# EAGLE design LTX-Rapidfire (EAGLE 6.5.0)
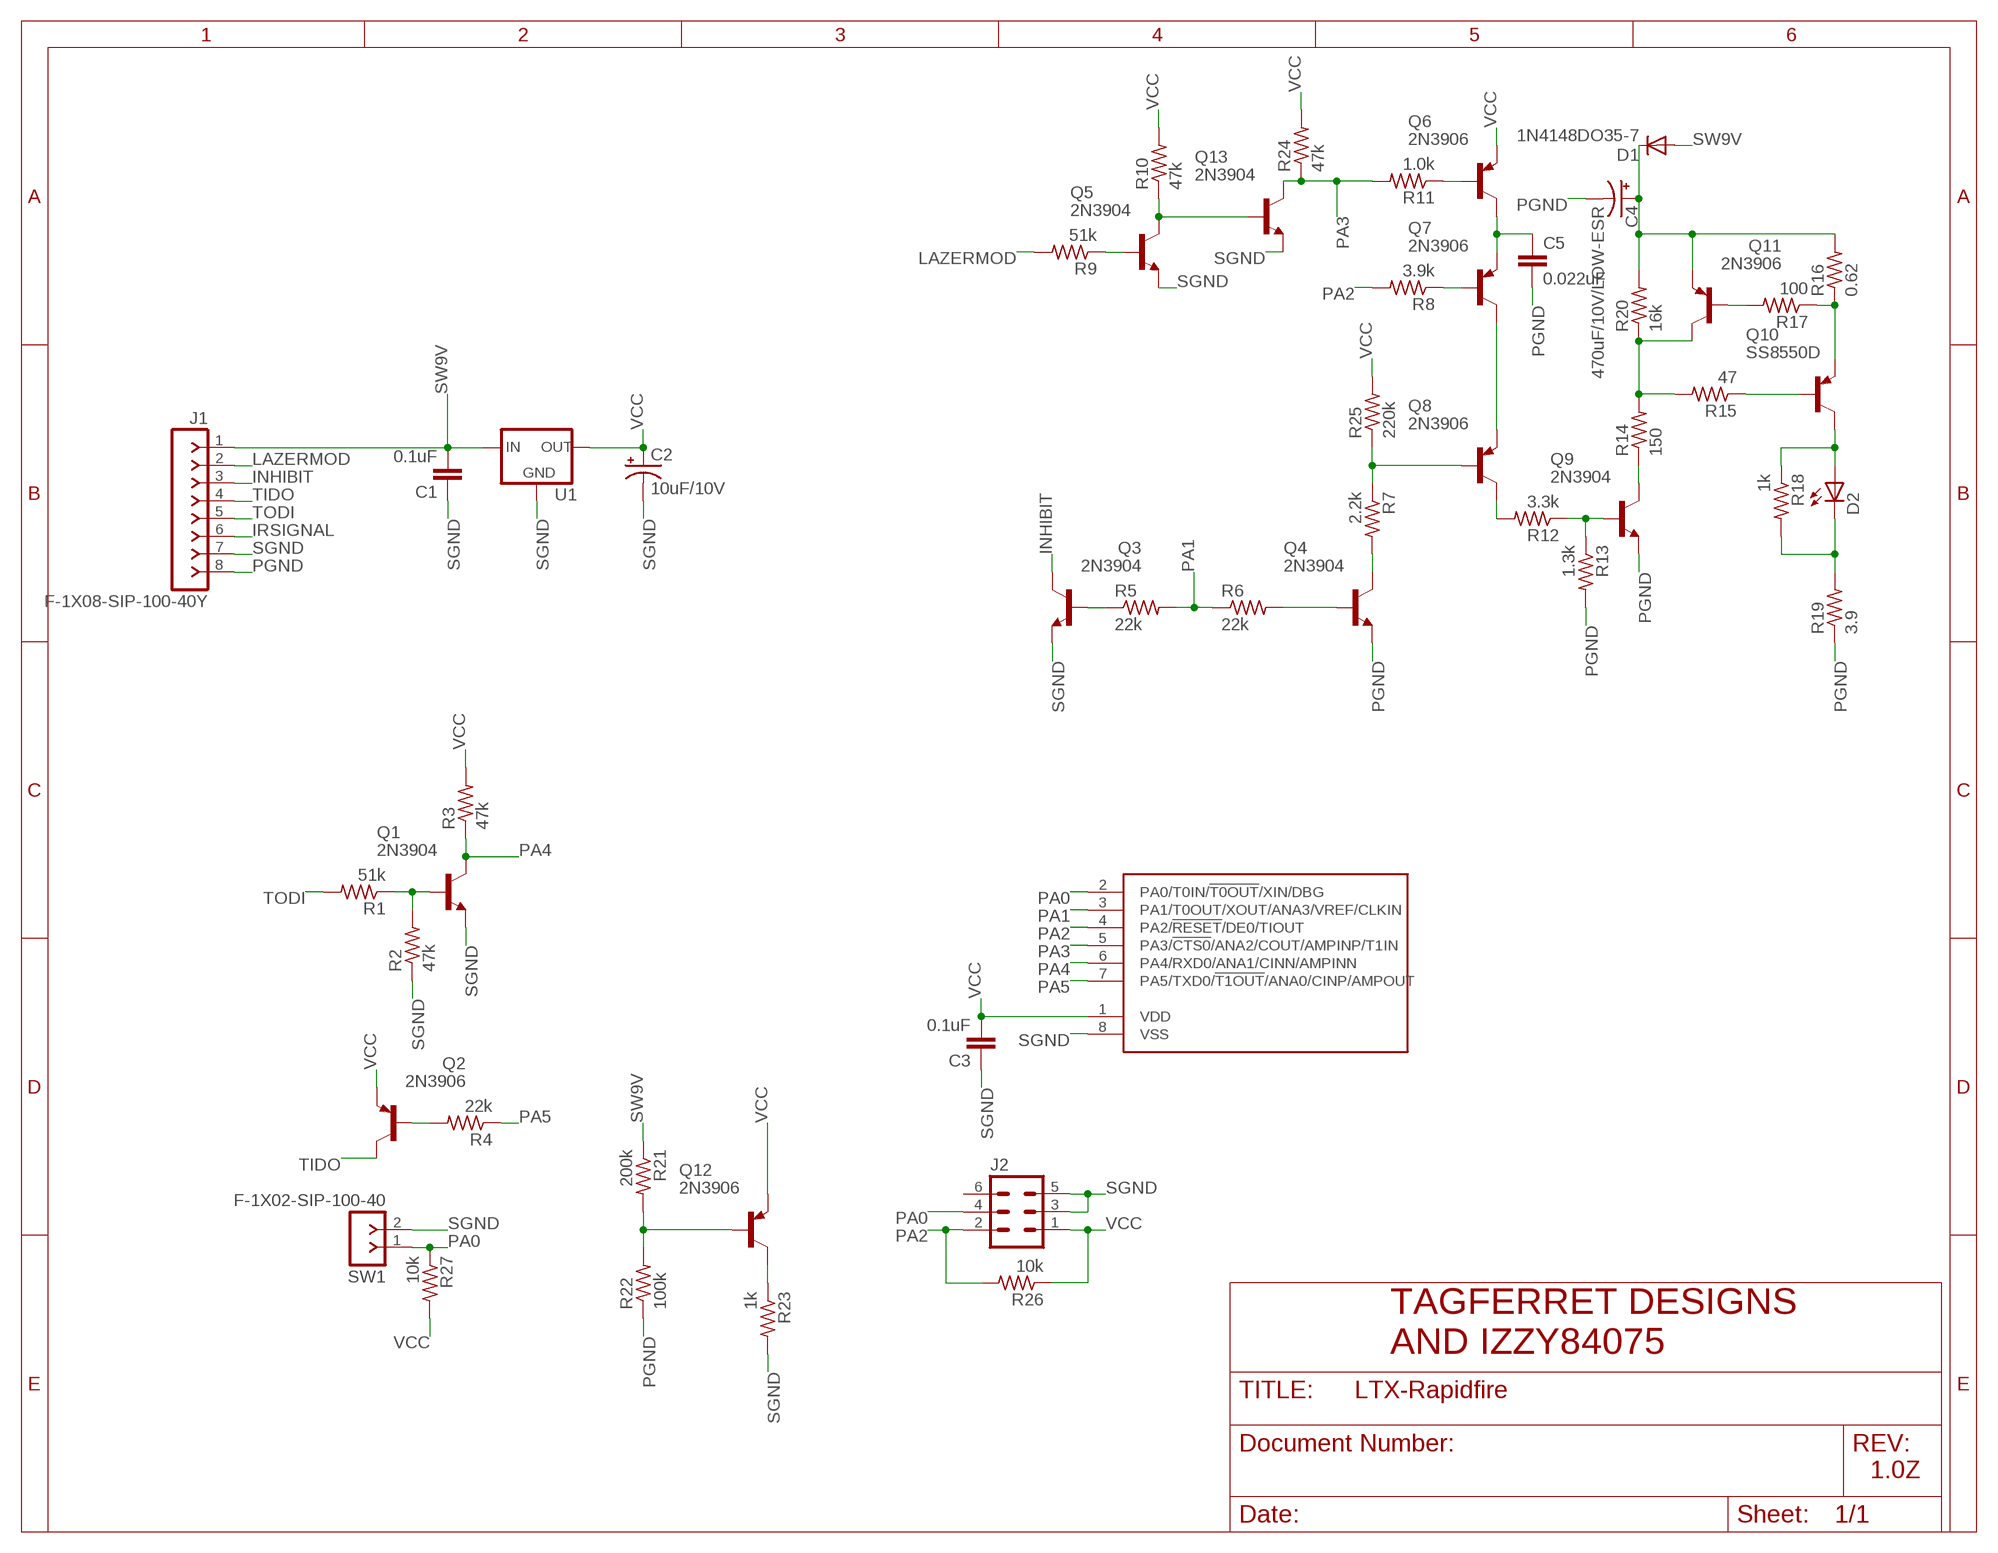
[diagram p0: schematic, sheet 1]

## Parts
C1  0.1uF  C-EU025-025X050  [C025-025X050]
C2  10uF/10V  CPOL-USE2-4  [E2-4]
C3  0.1uF  C-EU025-025X050  [C025-025X050]
C4  470uF/10V/LOW-ESR  CPOL-USE3.5-8  [E3,5-8]
C5  0.022uF  C-EU025-025X050  [C025-025X050]
D1  1N4148DO35-7  [DO35-7]
D2  LED5MM  [LED5MM]
J1  F-1X08-SIP-100-40Y  [SIP-100-08-40Y]
J2  MA03-2  [MA03-2]
Q1  2N3904  [TO92]
Q2  2N3906  [TO92]
Q3  2N3904  [TO92]
Q4  2N3904  [TO92]
Q5  2N3904  [TO92]
Q6  2N3906  [TO92]
Q7  2N3906  [TO92]
Q8  2N3906  [TO92]
Q9  2N3904  [TO92]
Q10  SS8550D  2N3906  [TO92]
Q11  2N3906  [TO92]
Q12  2N3906  [TO92]
Q13  2N3904  [TO92]
R1  51k  R-US_0204/7  [0204/7]
R2  47k  R-US_0204/2V  [0204V]
R3  47k  R-US_0204/2V  [0204V]
R4  22k  R-US_0204/7  [0204/7]
R5  22k  R-US_0204/7  [0204/7]
R6  22k  R-US_0204/7  [0204/7]
R7  2.2k  R-US_0204/7  [0204/7]
R8  3.9k  R-US_0204/7  [0204/7]
R9  51k  R-US_0204/7  [0204/7]
R10  47k  R-US_0204/2V  [0204V]
R11  1.0k  R-US_0204/7  [0204/7]
R12  3.3k  R-US_0204/7  [0204/7]
R13  1.3k  R-US_0204/2V  [0204V]
R14  150  R-US_0204/7  [0204/7]
R15  47  R-US_0204/7  [0204/7]
R16  0.62  R-US_0204/7  [0204/7]
R17  100  R-US_0204/2V  [0204V]
R18  1k  R-US_0204/2V  [0204V]
R19  3.9  R-US_0207/10  [0207/10]
R20  16k  R-US_0204/2V  [0204V]
R21  200k  R-US_0204/7  [0204/7]
R22  100k  R-US_0204/2V  [0204V]
R23  1k  R-US_0204/7  [0204/7]
R24  47k  R-US_0204/2V  [0204V]
R25  220k  R-US_0204/2V  [0204V]
R26  10k  R-US_0204/2V  [0204V]
R27  10k  R-US_0204/2V  [0204V]
SW1  F-1X02-SIP-100-40  [SIP-100-02-40]
U1  78LXX  [78LXX]
U2  Z8F082ADIL-8  [DIL8]

## Nets
INHIBIT: J1.3 Q3.1(C)
IRSIGNAL: J1.6
LAZERMOD: J1.2 R9.2
N$1: Q11.2(B) R17.2
N$2: C4.+ D1.C Q11.3(E) R16.2 R20.2
N$3: Q10.3(E) R16.1 R17.1
N$4: Q11.1(C) R14.2 R15.2 R20.1
N$5: Q10.2(B) R15.1
N$6: Q9.1(C) R14.1
N$7: D2.K(C) R18.2 R19.2
N$8: D2.A Q10.1(C) R18.1
N$9: Q9.2(B) R12.1 R13.1
N$10: Q8.1(C) R12.2
N$11: Q7.1(C) Q8.3(E)
N$12: Q8.2(B) R7.1 R25.1
N$13: Q7.2(B) R8.1
N$14: Q4.1(C) R7.2
N$15: C5.1 Q6.1(C) Q7.3(E)
N$16: Q4.2(B) R6.2
N$17: Q12.1(C) R23.1
N$18: Q3.2(B) R5.1
N$19: Q6.2(B) R11.1
N$20: Q12.2(B) R21.2 R22.2
N$21: Q5.1(C) Q13.2(B) R10.1
N$22: Q5.2(B) R9.1
N$24: Q1.2(B) R1.1 R2.2
N$25: Q2.2(B) R4.2
PA0: J2.4 R27.1 SW1.1 U2.2(PA0/T0IN/!T0OUT!/XIN/DBG)
PA1: R5.2 R6.1 U2.3(PA1/T0OUT/XOUT/ANA3/VREF/CLKIN)
PA2: J2.2 R8.2 R26.2 U2.4(PA2/!RESET!/DE0/TIOUT)
PA3: Q13.1(C) R11.2 R24.1 U2.5(PA3/!CTS0!/ANA2/COUT/AMPINP/T1IN)
PA4: Q1.1(C) R3.1 U2.6(PA4/RXD0/ANA1/CINN/AMPINN)
PA5: R4.1 U2.7(PA5/TXD0/!T1OUT!/ANA0/CINP/AMPOUT)
PGND: C4.- C5.2 J1.8 Q4.3(E) Q9.3(E) R13.2 R19.1 R22.1
SGND: C1.1 C2.- C3.1 J1.7 J2.3 J2.5 Q1.3(E) Q3.3(E) Q5.3(E) Q13.3(E) R2.1 R23.2 SW1.2 U1.GND U2.8(VSS)
SW9V: C1.2 D1.A J1.1 R21.1 U1.IN
TIDO: J1.4 Q2.1(C)
TODI: J1.5 R1.2
VCC: C2.+ C3.2 J2.1 Q2.3(E) Q6.3(E) Q12.3(E) R3.2 R10.2 R24.2 R25.2 R26.1 R27.2 U1.OUT U2.1(VDD)
Unconnected: J2.6

## Notes on the sheet
- TAGFERRET DESIGNS
  AND IZZY84075
- 1.0Z

## Library data of the parts
C1 C3 C5 = rcl:C-EU: CAPACITOR, European symbol
C2 C4 = rcl:CPOL-US: POLARIZED CAPACITOR, American symbol
D1 = diode:1N4148: DIODE high speed (Philips)
D2 = led:LED: LED OSRAM: - CHIPLED LG R971, LG N971, LY N971, LG Q971, LY Q971, LO R971, LY R971 LH N974, LH R974 LS Q976, LO Q976, LY Q976 LO Q996 - Hyper CHIPLED LW Q18S LB Q993, LB Q99A, LB R99A - SideLED LS A670, LO A670, LY A670, LG A670, LP A670 LB A673, LV A673, LT A673, LW A673 LH A674 LY A675 LS A676, LA A676, LO A676, LY A676, LW A676 LS A679, LY A679, LG A679 - Hyper Micro SIDELED® LS Y876, LA Y876, LO Y876, LY Y876 LT Y87S - SmartLED LW L88C, LW L88S LB L89C, LB L89S, LG L890 LS L89K, LO L89K, LY L89K LS L896, LA L896, LO L896, LY L896 - TOPLED LS T670, LO T670, LY T670, LG T670, LP T670 LSG T670, LSP T670, LSY T670, LOP T670, LYG T670 LG T671, LOG T671, LSG T671 LB T673, LV T673, LT T673, LW T673 LH T674 LS T676, LA T676, LO T676, LY T676, LB T676, LH T676, LSB T676, LW T676 LB T67C, LV T67C, LT T67C, LS T67K, LO T67K, LY T67K, LW E67C LS E67B, LA E67B, LO E67B, LY E67B, LB E67C, LV E67C, LT E67C LW T67C LS T679, LY T679, LG T679 LS T770, LO T770, LY T770, LG T770, LP T770 LB T773, LV T773, LT T773, LW T773 LH T774 LS E675, LA E675, LY E675, LS T675 LS T776, LA T776, LO T776, LY T776, LB T776 LHGB T686 LT T68C, LB T68C - Hyper Mini TOPLED® LB M676 - Mini TOPLED Santana® LG M470 LS M47K, LO M47K, LY M47K Source: http://www.osram.convergy.de LUXEON: - LUMILED® LXK2-PW12-R00, LXK2-PW12-S00, LXK2-PW14-U00, LXK2-PW14-V00 LXK2-PM12-R00, LXK2-PM12-S00, LXK2-PM14-U00 LXK2-PE12-Q00, LXK2-PE12-R00, LXK2-PE12-S00, LXK2-PE14-T00, LXK2-PE14-U00 LXK2-PB12-K00, LXK2-PB12-L00, LXK2-PB12-M00, LXK2-PB14-N00, LXK2-PB14-P00, LXK2-PB14-Q00 LXK2-PR12-L00, LXK2-PR12-M00, LXK2-PR14-Q00, LXK2-PR14-R00 LXK2-PD12-Q00, LXK2-PD12-R00, LXK2-PD12-S00 LXK2-PH12-R00, LXK2-PH12-S00 LXK2-PL12-P00, LXK2-PL12-Q00, LXK2-PL12-R00 Source: www.luxeon.com KINGBRIGHT: KA-3528ASYC Source: www.kingbright.com
J1 = con-headers-jp:F-1X08-: FEMALE HEADER
J2 = izzy:MA03-2: PIN HEADER; OC_FARNELL: unknown; OC_NEWARK: unknown
Q1 Q3-Q5 Q9 Q13 = transistor:2N3904: NPN TRANSISTOR
Q2 Q6-Q8 Q10-Q12 = transistor-pnp:2N3906: PNP Transistor
R1-R27 = rcl:R-US_: RESISTOR, American symbol
SW1 = con-headers-jp:F-1X02-: FEMALE HEADER
U1 = v-reg:78LXX: VOLTAGE REGULATOR
U2 = izzy:Z8F082A: Zilog Z8F082A-SO08

## Board
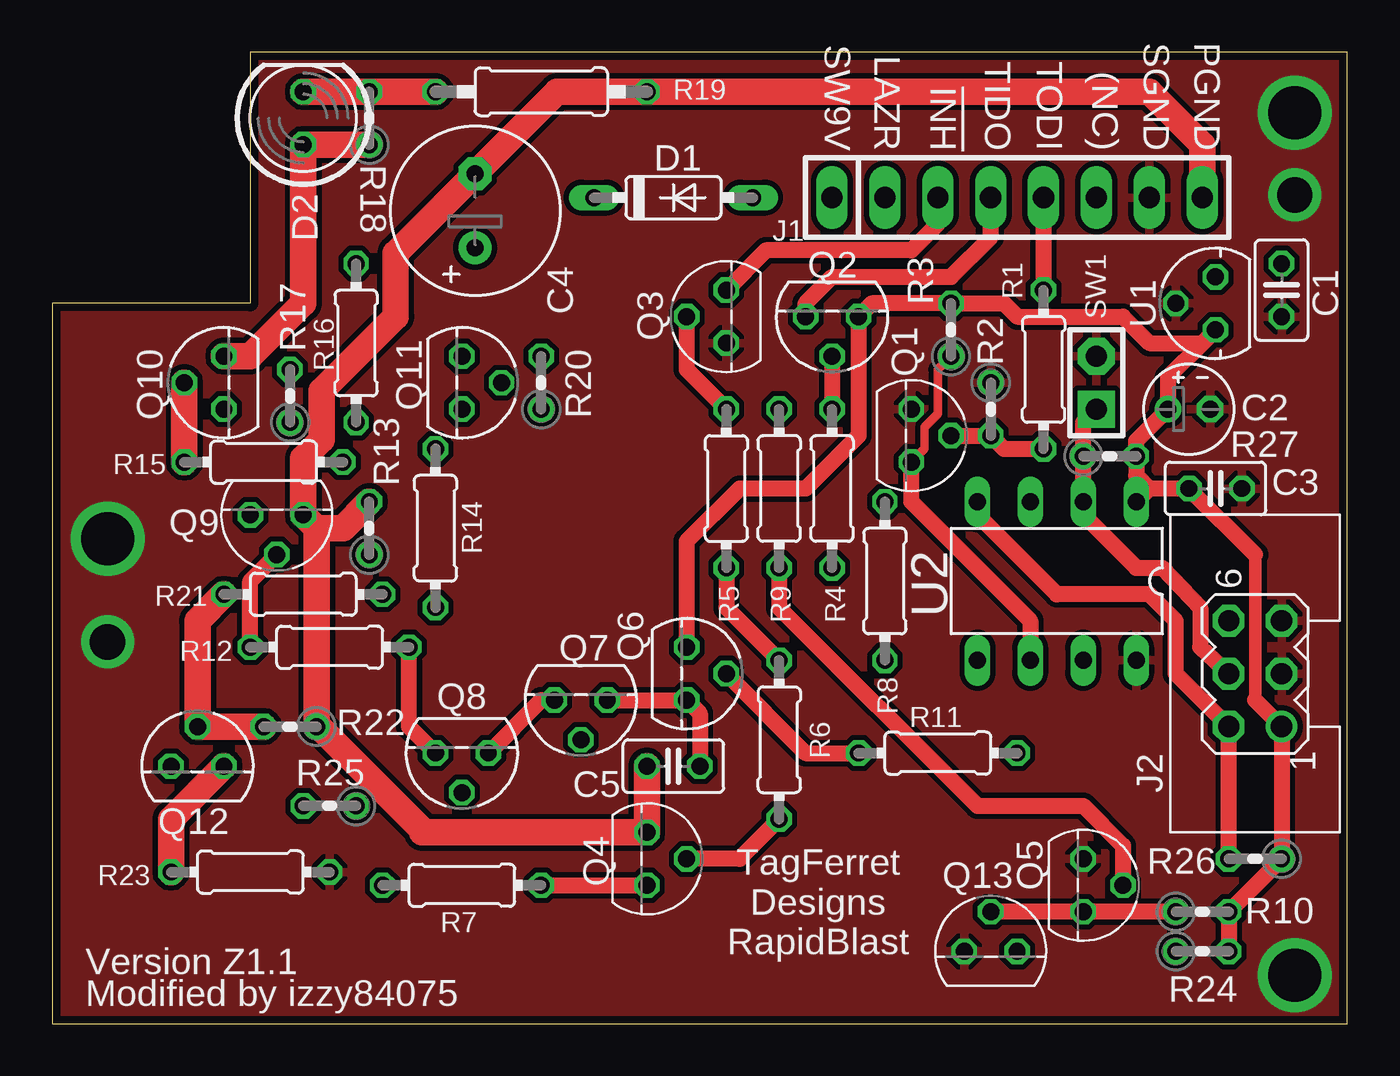
[diagram p1: board, top side]
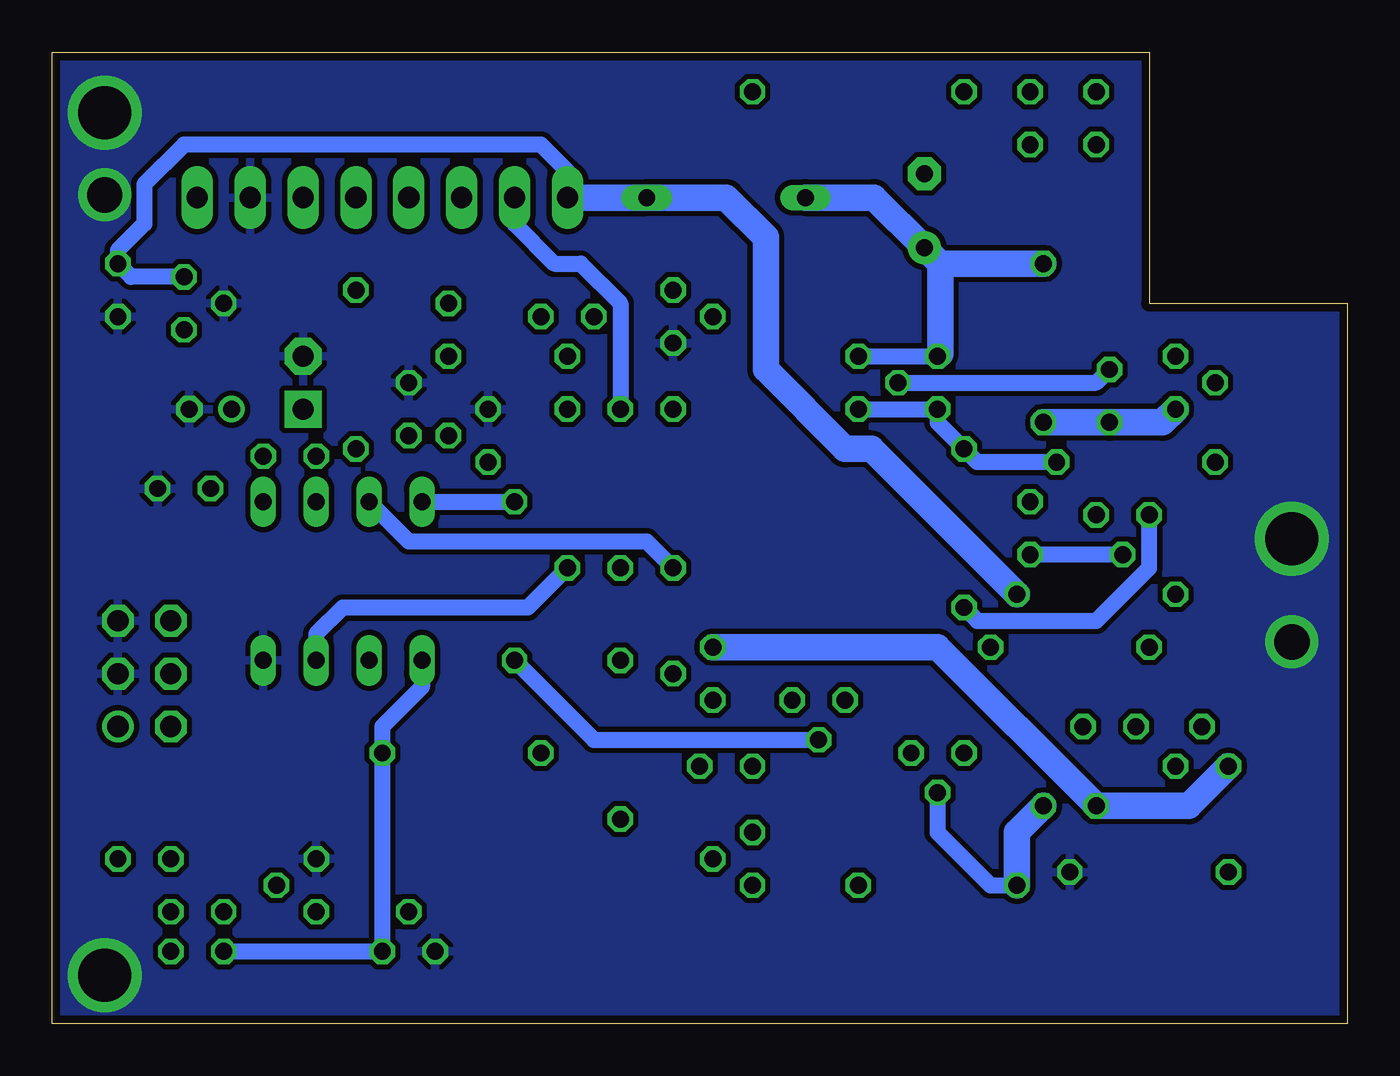
[diagram p2: board, bottom side, seen from below]

Size 62.22 x 46.66 mm. Coordinates in mm from the lower left corner, seen from the top.
Outline: 62.22,0 62.22,0
Outline: 62.22,0 62.22,46.66 9.53,46.66 9.53,34.6 0,34.6 0,0 62.22,0
Copper layers (1*16): Top 0.0356mm / dielectric 1.5011mm / Bottom 0.0356mm
Design rules "LaenPCBOrder": minimum track width 6mil, minimum drill 13mil, track to track 6mil, track to pad 6mil, pad to pad 6mil, via to via 6mil, smd to smd 6mil, copper to edge 15mil, drill to drill 6mil, minimum pad ring 7mil, minimum via ring 7mil, stop-mask expansion 4mil, vias tented up to drill 0mil, thermal gap 10mil

### Footprints (pad centres in the part's own frame; a part is rotated, then mirrored left to right if it is on the bottom)
C025-025X050 = drill 0.813 octagon: 1 -1.27,0; 2 1.27,0
E2-4 = drill 0.813 pad 1.27: + -1.016,0 | drill 0.813 pad 1.27 octagon: - 1.016,0
E3,5-8 = drill 0.813 pad 1.6: + -1.778,0 | drill 0.813 pad 1.6 octagon: - 1.778,0
DO35-7 = drill 0.813 long: A 3.81,0; C -3.81,0
LED5MM = drill 0.813 octagon: A -1.27,0; K 1.27,0
SIP-100-08-40Y = drill 1.016 long: 1 -8.89,0; 2 -6.35,0; 3 -3.81,0; 4 -1.27,0; 5 1.27,0; 6 3.81,0; 7 6.35,0; 8 8.89,0
MA03-2 = drill 1.016: 1 -2.54,-1.27 | drill 1.016 octagon: 2 -2.54,1.27; 3 0,-1.27; 4 0,1.27; 5 2.54,-1.27; 6 2.54,1.27
TO92 = drill 0.813 octagon: 1 1.27,0; 2 0,1.905; 3 -1.27,0
0204/7 = drill 0.813 octagon: 1 -3.81,0; 2 3.81,0
0204V = drill 0.813 octagon: 1 -1.27,0; 2 1.27,0
0207/10 = drill 0.813 octagon: 1 -5.08,0; 2 5.08,0
SIP-100-02-40 = drill 1.016 pad 1.778 square: 1 -1.27,0 | drill 1.016 pad 1.778 octagon: 2 1.27,0
78LXX = drill 0.813 octagon: GND 0,1.905; IN 1.27,0; OUT -1.27,0
DIL8 = drill 0.813 long: 1 -3.81,-3.81; 2 -1.27,-3.81; 3 1.27,-3.81; 4 3.81,-3.81; 5 3.81,3.81; 6 1.27,3.81; 7 -1.27,3.81; 8 -3.81,3.81

### Placement (x,y rotation side)
C1  59.05,35.23 90 top
C2  54.61,29.52 0 top
C3  55.88,25.7 180 top
C4  20.32,39.04 90 top
C5  29.84,12.37 180 top
D1  29.84,39.67 0 top
D2  12.06,43.48 90 top
J1  46.35,39.67 0 top
J2  57.78,16.82 90 top
Q1  41.27,28.25 270 top
Q2  37.47,33.96 180 top
Q3  32.38,33.96 90 top
Q4  28.57,7.93 270 top
Q5  49.53,6.66 270 top
Q6  30.48,16.82 270 top
Q7  25.4,15.54 180 top
Q8  19.68,13 180 top
Q9  10.79,24.43 180 top
Q10  8.26,30.79 90 top
Q11  19.68,30.79 270 top
Q12  6.99,12.37 0 top
Q13  45.09,3.48 0 top
R1  47.62,31.42 90 top
R2  45.09,29.52 270 top
R3  43.18,33.33 90 top
R4  37.47,25.7 90 top
R5  32.38,25.7 270 top
R6  34.92,13.64 270 top
R7  19.68,6.66 0 top
R8  40.01,21.26 90 top
R9  34.92,25.7 90 top
R10  55.24,5.39 0 top
R11  42.55,13 0 top
R12  13.34,18.09 0 top
R13  15.24,23.8 90 top
R14  18.41,23.8 90 top
R15  10.16,26.97 0 top
R16  14.61,32.69 90 top
R17  11.43,30.15 90 top
R18  15.24,43.48 90 top
R19  23.5,44.76 180 top
R20  23.5,30.79 90 top
R21  12.06,20.62 180 top
R22  11.43,14.28 180 top
R23  9.53,7.29 0 top
R24  55.24,3.48 0 top
R25  13.34,10.46 180 top
R26  57.78,7.93 180 top
R27  50.8,27.25 0 top
SW1  50.16,30.79 90 top
U1  55.88,34.59 90 top
U2  48.26,21.26 180 top

### Tracks (layer width: path | path; a pad name or v marks a point on that pad's centre or on a via)
INHIBIT
  Top 0.762: J1.3 42.55,38.41 41.27,37.14 34.29,37.14 Q3.1
LAZERMOD
  Bottom 0.762: J1.2 40.01,38.41 38.1,36.5 36.83,36.5 34.92,34.6 R9.2
N$1
  Bottom 0.762: Q11.2 12.06,30.79 R17.2
N$2
  Bottom 0.762: R20.2 Q11.3 19.56,32.18
  Bottom 1.27: R16.2 19.56,36.5 | 19.56,36.5 C4.+ 22.73,39.68 D1.C | 19.56,32.18 19.56,36.5
N$3
  Bottom 1.27: Q10.3 8.89,28.88 R17.1 R16.1
N$4
  Bottom 0.762: R15.2 17.78,26.98 R14.2 19.68,28.88 Q11.1 R20.1
N$5
  Top 1.27: Q10.2 R15.1
N$6
  Bottom 0.762: R14.1 17.78,19.36 12.06,19.36 9.53,21.9 Q9.1
N$7
  Top 1.27: R19.2 R18.2 D2.K
N$8
  Top 1.27: R18.1 D2.A 12.06,34.6 9.53,32.06 Q10.1
N$9
  Top 0.762: R12.1 9.53,21.26 Q9.2
  Bottom 0.762: Q9.2 R13.1
N$10
  Top 0.762: Q8.1 17.14,14.28 R12.2
N$11
  Top 0.762: Q8.3 23.5,15.55 Q7.1
N$12
  Bottom 0.762: Q8.2 19.68,9.2 17.14,6.66 R7.1
  Bottom 1.27: R25.1 15.88,9.2 R7.1
N$13
  Bottom 0.762: R8.1 36.2,13.64 Q7.2
N$14
  Top 0.762: R7.2 Q4.1
N$15
  Top 0.762: Q7.3 Q6.1 31.11,14.91 C5.1
N$16
  Top 0.762: R6.2 33.02,7.93 Q4.2
N$17
  Top 1.27: R23.1 5.71,9.83 Q12.1
N$18
  Top 0.762: Q3.2 30.48,31.42 R5.1
N$19
  Top 0.762: Q6.2 36.2,13.01 R11.1
N$20
  Top 1.27: R21.2 6.99,19.36 Q12.2 R22.2
N$21
  Top 0.762: R10.1 Q5.1 Q13.2
N$22
  Top 0.762: R9.1 34.92,19.99 44.45,10.47 49.53,10.47 51.44,8.56 Q5.2
N$24
  Top 0.762: Q1.2 R2.2 45.72,27.61 R1.1
N$25
  Top 0.762: Q2.2 R4.2
PA0
  Top 0.762: J2.4 55.14,18.09 55.14,19.99 53.34,21.9 52.07,21.9 49.53,24.44 U2.2 R27.1 49.53,28.88 SW1.1
PA1
  Top 0.762: R5.2 32.38,19.99 R6.1
  Bottom 0.762: U2.3 45.09,23.17 33.66,23.17 R5.2
PA2
  Top 0.762: R26.2 J2.2 53.98,16.82 53.98,19.36 52.7,20.63 48.26,20.63 44.45,24.44 U2.4
  Bottom 0.762: U2.4 R8.2
PA3
  Bottom 0.762: U2.5 44.45,16.18 46.35,14.28 R11.2 Q13.1 R24.1
PA4
  Top 0.406: R3.1 42.55,31.42 42.55,29.29 41.91,28.65 41.91,27.61 Q1.1
  Top 0.762: U2.6 46.99,19.36 41.27,25.07 Q1.1
PA5
  Bottom 0.762: R4.1 39.37,19.99 48.26,19.99 49.53,18.72 U2.7
PGND
  Top 1.27: J1.8 55.24,42.22 52.7,44.76 R19.1 24.26,44.76 C4.- 16.51,37.01 16.51,33.96 12.95,30.4 12.95,28.04 12.06,27.15 Q9.3 12.7,23.8 | C5.2 Q4.3 17.78,9.2 17.78,9.32 12.83,14.28 R22.1 12.7,23.8 | R13.2 13.97,23.8 12.7,23.8
SGND  (via drill 1.7, 2.54)
  other vias: 59.69,43.74 59.69,2.34 2.67,18.34 59.69,39.8 2.67,23.29
  pour Bottom (isolate 0.254): 62.23,46.66 62.23,0 0,0 0,34.59 9.53,34.59 9.53,46.66
  pour Top (isolate 0.254): 62.23,46.66 62.23,0 0,0 0,34.59 9.53,34.59 9.53,46.66
SW9V
  Bottom 0.762: J1.1 37.47,40.95 38.73,42.22 55.88,42.22 57.78,40.31 57.78,38.41 59.05,37.14 C1.2 58.42,35.87 U1.IN
  Bottom 1.27: J1.1 D1.A 29.84,39.68 27.94,37.77 27.94,31.42 24.13,27.61 22.86,27.61 R21.1
TIDO
  Top 0.762: Q2.1 36.2,34.6 37.47,35.87 43.18,35.87 45.09,37.77 J1.4
TODI
  Top 0.762: J1.5 R1.2
VCC
  Top 0.61: 57.78,22.53 57.78,15.55
  Top 0.762: U1.OUT 55.24,32.69 | 55.24,32.69 53.59,31.04 C2.+ 52.07,27.99 R27.2 52.07,26.34 52.7,25.71 | 57.78,22.53 C3.2 52.7,25.71 | 57.78,15.55 J2.1 R26.1 R10.2 R24.2 | 55.24,32.69 52.7,32.69 51.44,33.96 46.35,33.96 45.72,34.6 R3.2 39.37,34.6 Q2.3 38.73,28.25 36.2,25.71 33.02,25.71 30.48,23.17 Q6.3 | 52.7,25.71 U2.1
  Bottom 1.27: Q12.3 7.62,10.47 R25.2 19.68,18.09 Q6.3

### Text on the board
tNames: SW9V | LAZR | !INH | TIDO | TODI | (NC) | SGND | PGND | TagFerret / Designs / RapidBlast | Version Z1.1 | Modified by izzy84075